# Altium schematic sheet Memory.SchDoc
size A
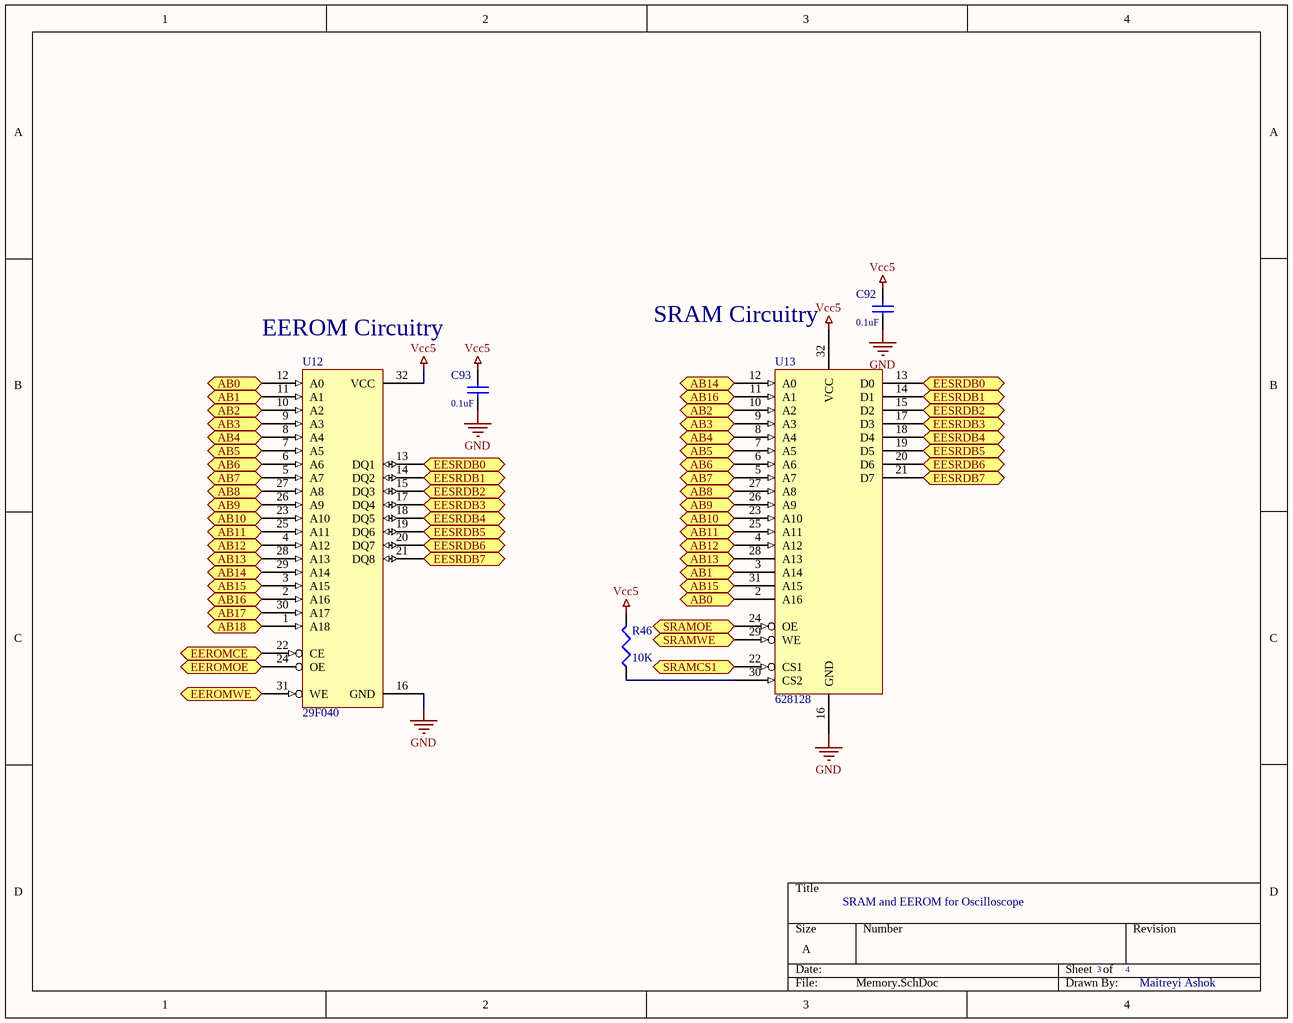
[diagram p0: Memory.SchDoc]

## Parts
C92  value 0.1uF  [1608[0603]]  (hidden comment: Cap)
C93  value 0.1uF  [1608[0603]]  (hidden comment: Cap)
R46  value 10K  [J1-0603]  (hidden comment: Res3)
U12  29F040  [PLCCS32]
U13  628128  [DIPS32]

## Ports
AB0 (in), AB1 (in), AB2 (in), AB3 (in), AB4 (in), AB5 (in), AB6 (in), AB7 (in), AB8 (in), AB9 (in), AB10 (in), AB11 (in), AB12 (in), AB13 (in), AB14 (in), AB15 (in), AB16 (in), AB17 (in), AB18 (in), EEROMCE (in), EEROMOE (in), EEROMWE (in), EESRDB0 (bidir), EESRDB1 (bidir), EESRDB2 (bidir), EESRDB3 (bidir), EESRDB4 (bidir), EESRDB5 (bidir), EESRDB6 (bidir), EESRDB7 (bidir), SRAMCS1 (in), SRAMOE (in), SRAMWE (in)

## Nets
GND: C92.1 C93.1 U12.16(GND) U13.16(GND)
VCC: C92.2 C93.2 R46.2 U12.32(VCC) U13.32(VCC)  [also labelled Vcc5]
AB0: U12.12(A0) U13.2(A16) ; port AB0
AB1: U12.11(A1) U13.3(A14) ; port AB1
AB2: U12.10(A2) U13.10(A2) ; port AB2
AB3: U12.9(A3) U13.9(A3) ; port AB3
AB4: U12.8(A4) U13.8(A4) ; port AB4
AB5: U12.7(A5) U13.7(A5) ; port AB5
AB6: U12.6(A6) U13.6(A6) ; port AB6
AB7: U12.5(A7) U13.5(A7) ; port AB7
AB8: U12.27(A8) U13.27(A8) ; port AB8
AB9: U12.26(A9) U13.26(A9) ; port AB9
AB10: U12.23(A10) U13.23(A10) ; port AB10
AB11: U12.25(A11) U13.25(A11) ; port AB11
AB12: U12.4(A12) U13.4(A12) ; port AB12
AB13: U12.28(A13) U13.28(A13) ; port AB13
AB14: U12.29(A14) U13.12(A0) ; port AB14
AB15: U12.3(A15) U13.31(A15) ; port AB15
AB16: U12.2(A16) U13.11(A1) ; port AB16
AB17: U12.30(A17) ; port AB17
AB18: U12.1(A18) ; port AB18
EEROMCE: U12.22(CE) ; port EEROMCE
EEROMOE: U12.24(OE) ; port EEROMOE
EEROMWE: U12.31(WE) ; port EEROMWE
EESRDB0: U12.13(DQ1) U13.13(D0) ; port EESRDB0
EESRDB1: U12.14(DQ2) U13.14(D1) ; port EESRDB1
EESRDB2: U12.15(DQ3) U13.15(D2) ; port EESRDB2
EESRDB3: U12.17(DQ4) U13.17(D3) ; port EESRDB3
EESRDB4: U12.18(DQ5) U13.18(D4) ; port EESRDB4
EESRDB5: U12.19(DQ6) U13.19(D5) ; port EESRDB5
EESRDB6: U12.20(DQ7) U13.20(D6) ; port EESRDB6
EESRDB7: U12.21(DQ8) U13.21(D7) ; port EESRDB7
SRAMCS1: U13.22(CS1) ; port SRAMCS1
SRAMOE: U13.24(OE) ; port SRAMOE
SRAMWE: U13.29(WE) ; port SRAMWE
NetR46_1: R46.1 U13.30(CS2)

## Notes on the sheet
- EEROM Circuitry
- SRAM Circuitry
- SRAM and EEROM for Oscilloscope
- 3            4
- Maitreyi Ashok

## Library data of the parts
C92 C93 = Cap: Capacitor; Published: 8-Jun-2000; LatestRevisionDate: 17-Jul-2002; LatestRevisionNote: Re-released for DXP Platform.; PackageReference: RAD-0.3; Publisher: Altium Limited; PackageDescription: Radial Cap, Thru-Hole; 2 Leads; 0.3 in Pin Spacing
R46 = Res3: Resistor; Published: 8-Jun-2000; LatestRevisionDate: 29-May-2009; LatestRevisionNote: IPC-7351 Footprint Added.; PackageReference: J1-0603; Publisher: Altium Limited; PackageDescription: Chip Resistor
U12 = 29F040: 4 Megabit (512K x 8) CMOS Uniform Sector Flash Memory
U13 = 628128: 1 M SRAM (128-kword x 8-bit)